# EAGLE design stm32f103_ethernet_shield (EAGLE 9.6.2)
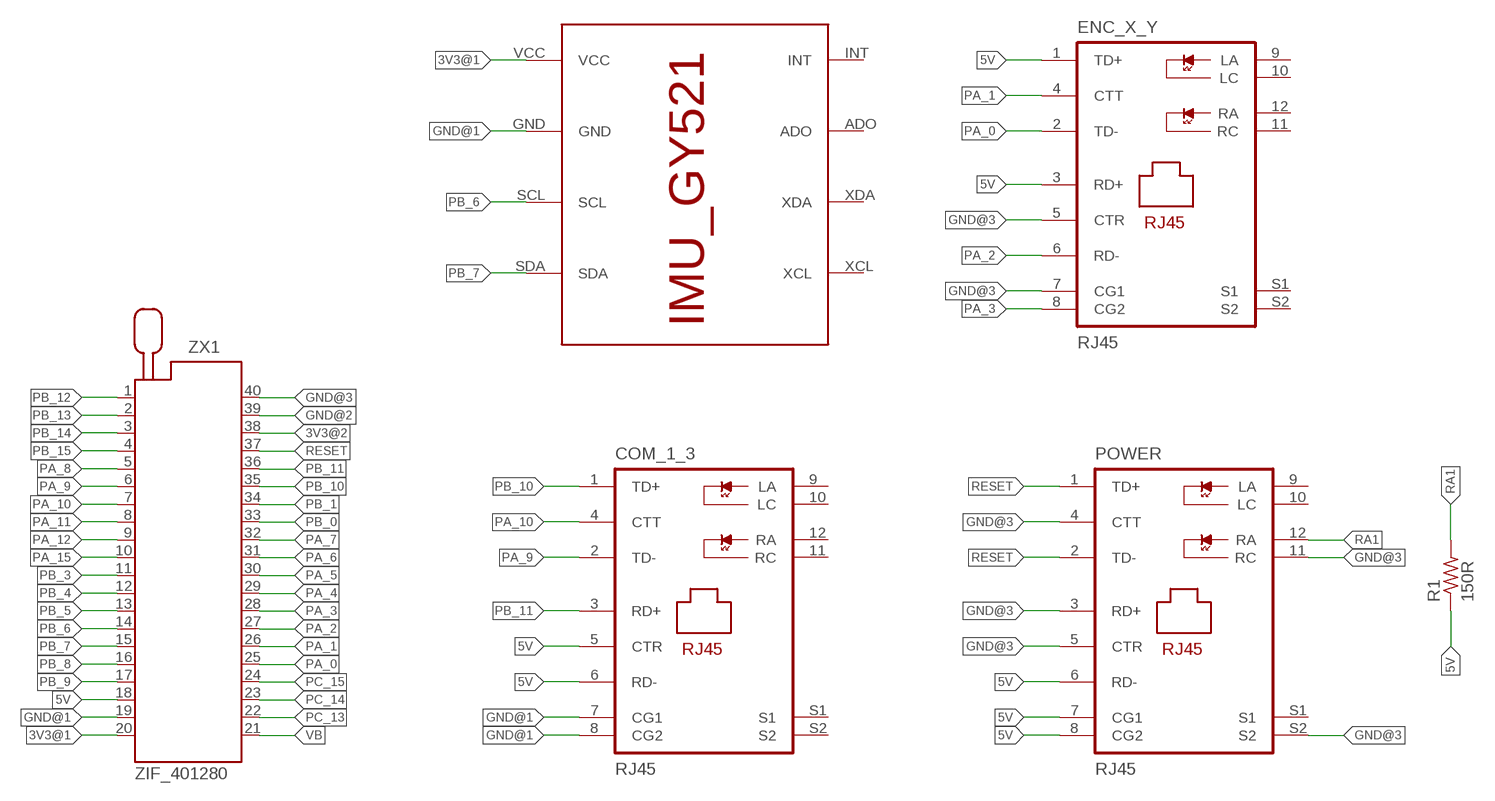
[diagram p0: schematic, sheet 1]

## Parts
COM_1_3  RJ45  RJ45_METAL_LEDS  [J0-A/B/F]
ENC_X_Y  RJ45  RJ45_METAL_LEDS  [J0-A/B/F]
MPU6050  IMU_ROBOCON_GY521  [IMU_GY521]
POWER  RJ45  RJ45_METAL_LEDS  [J0-A/B/F]
R1  150R  RES-7  [0204/7]
ZX1  ZIF_401280  [240-1280-00-0602J]

## Nets
3V3@1: MPU6050.VCC ZX1.20
3V3@2: ZX1.38
5V: COM_1_3.5(CTR) COM_1_3.6(RD-) ENC_X_Y.1(TD+) ENC_X_Y.3(RD+) POWER.6(RD-) POWER.7(CG1) POWER.8(CG2) R1.1 ZX1.18
GND@1: COM_1_3.7(CG1) COM_1_3.8(CG2) MPU6050.GND ZX1.19
GND@2: ZX1.39
GND@3: ENC_X_Y.5(CTR) ENC_X_Y.7(CG1) POWER.3(RD+) POWER.4(CTT) POWER.5(CTR) POWER.11(RC) POWER.S2 ZX1.40
PA_0: ENC_X_Y.2(TD-) ZX1.25
PA_1: ENC_X_Y.4(CTT) ZX1.26
PA_2: ENC_X_Y.6(RD-) ZX1.27
PA_3: ENC_X_Y.8(CG2) ZX1.28
PA_4: ZX1.29
PA_5: ZX1.30
PA_6: ZX1.31
PA_7: ZX1.32
PA_8: ZX1.5
PA_9: COM_1_3.2(TD-) ZX1.6
PA_10: COM_1_3.4(CTT) ZX1.7
PA_11: ZX1.8
PA_12: ZX1.9
PA_15: ZX1.10
PB_0: ZX1.33
PB_1: ZX1.34
PB_3: ZX1.11
PB_4: ZX1.12
PB_5: ZX1.13
PB_6: MPU6050.SCL ZX1.14
PB_7: MPU6050.SDA ZX1.15
PB_8: ZX1.16
PB_9: ZX1.17
PB_10: COM_1_3.1(TD+) ZX1.35
PB_11: COM_1_3.3(RD+) ZX1.36
PB_12: ZX1.1
PB_13: ZX1.2
PB_14: ZX1.3
PB_15: ZX1.4
PC_13: ZX1.22
PC_14: ZX1.23
PC_15: ZX1.24
RA1: POWER.12(RA) R1.2
RESET: POWER.1(TD+) POWER.2(TD-) ZX1.37
VB: ZX1.21
Unconnected: COM_1_3.9(LA) COM_1_3.10(LC) COM_1_3.11(RC) COM_1_3.12(RA) COM_1_3.S1 COM_1_3.S2 ENC_X_Y.9(LA) ENC_X_Y.10(LC) ENC_X_Y.11(RC) ENC_X_Y.12(RA) ENC_X_Y.S1 ENC_X_Y.S2 MPU6050.ADO MPU6050.INT MPU6050.XCL MPU6050.XDA POWER.9(LA) POWER.10(LC) POWER.S1

## Library data of the parts
COM_1_3 POWER = MIA_LIBRARY-2-2-2:RJ45_METAL_LEDS: RJ45 PulseJack w/LEDs
ENC_X_Y = MIA_LIBRARY-2-2-2:RJ45_METAL_LEDS: RJ45 PulseJack w/LEDs; SPICEPREFIX: X
MPU6050 = MIA_LIBRARY-2-2-2:IMU_ROBOCON_GY521
R1 = MIA_LIBRARY-2-2-2:RES-7
ZX1 = MIA_LIBRARY-2-2-2:ZIF_40: Zero Insertion Force Socked Source: http://www.3M.com/ehpd

## Board
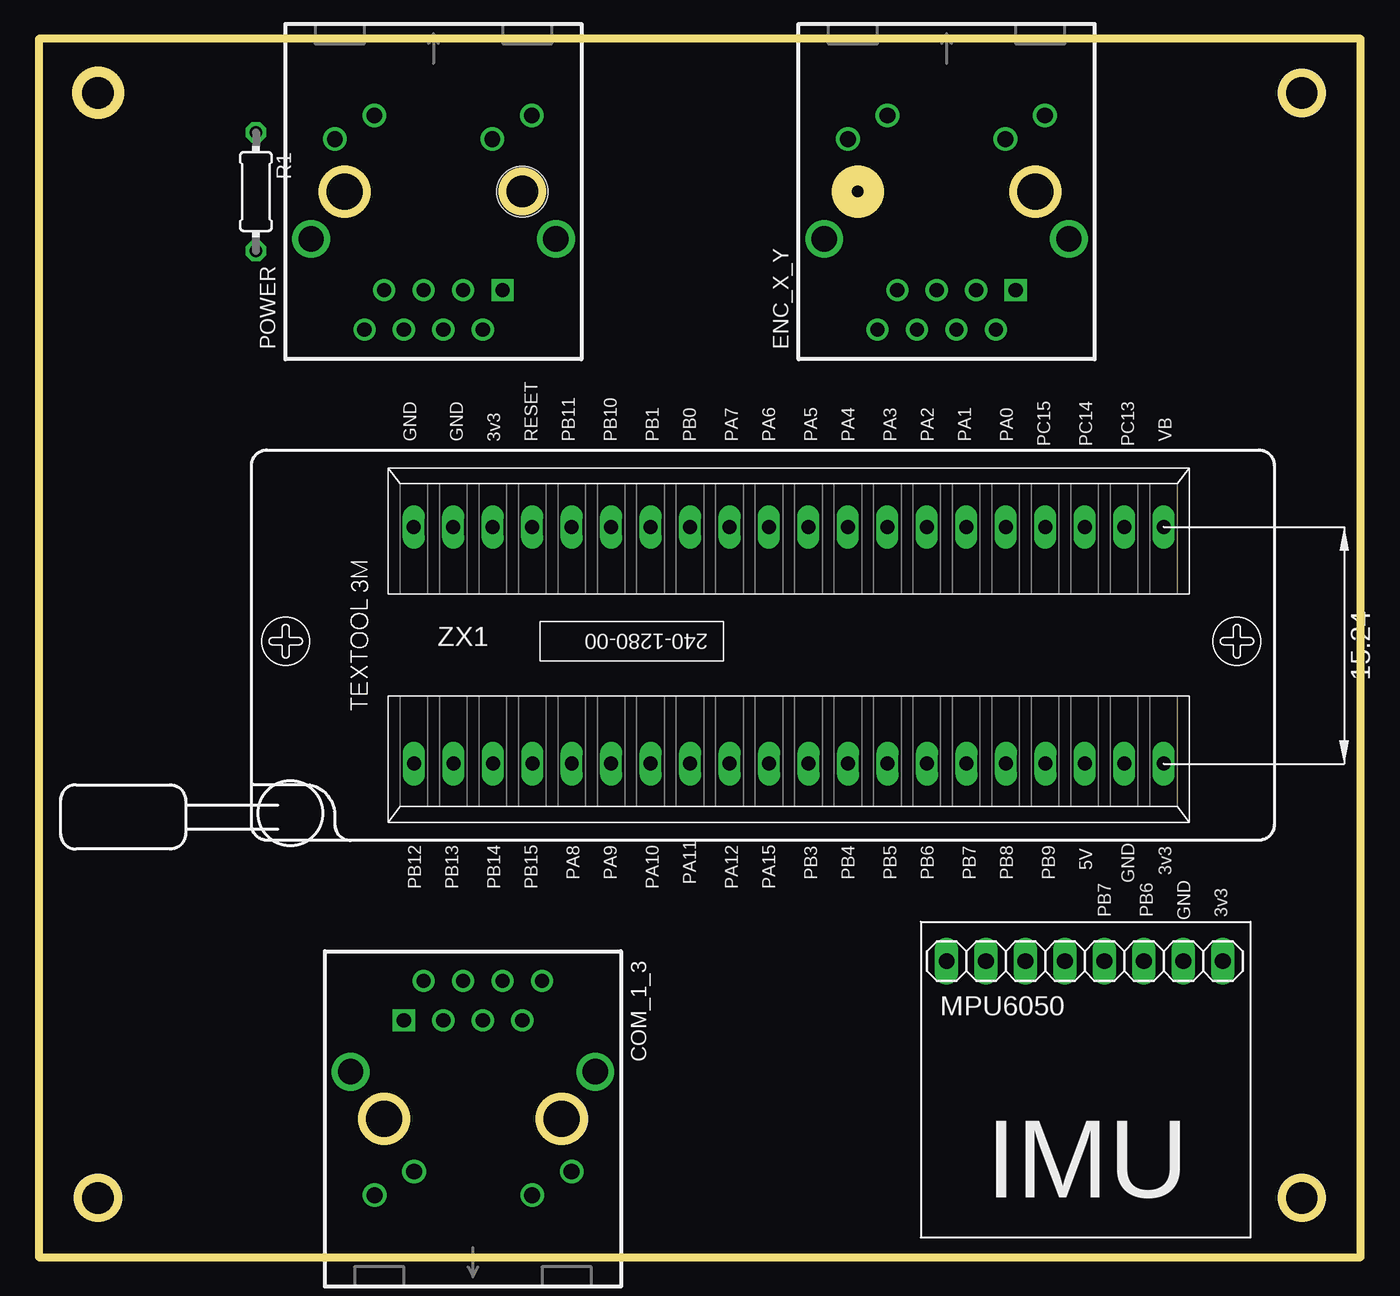
[diagram p1: board, top side]
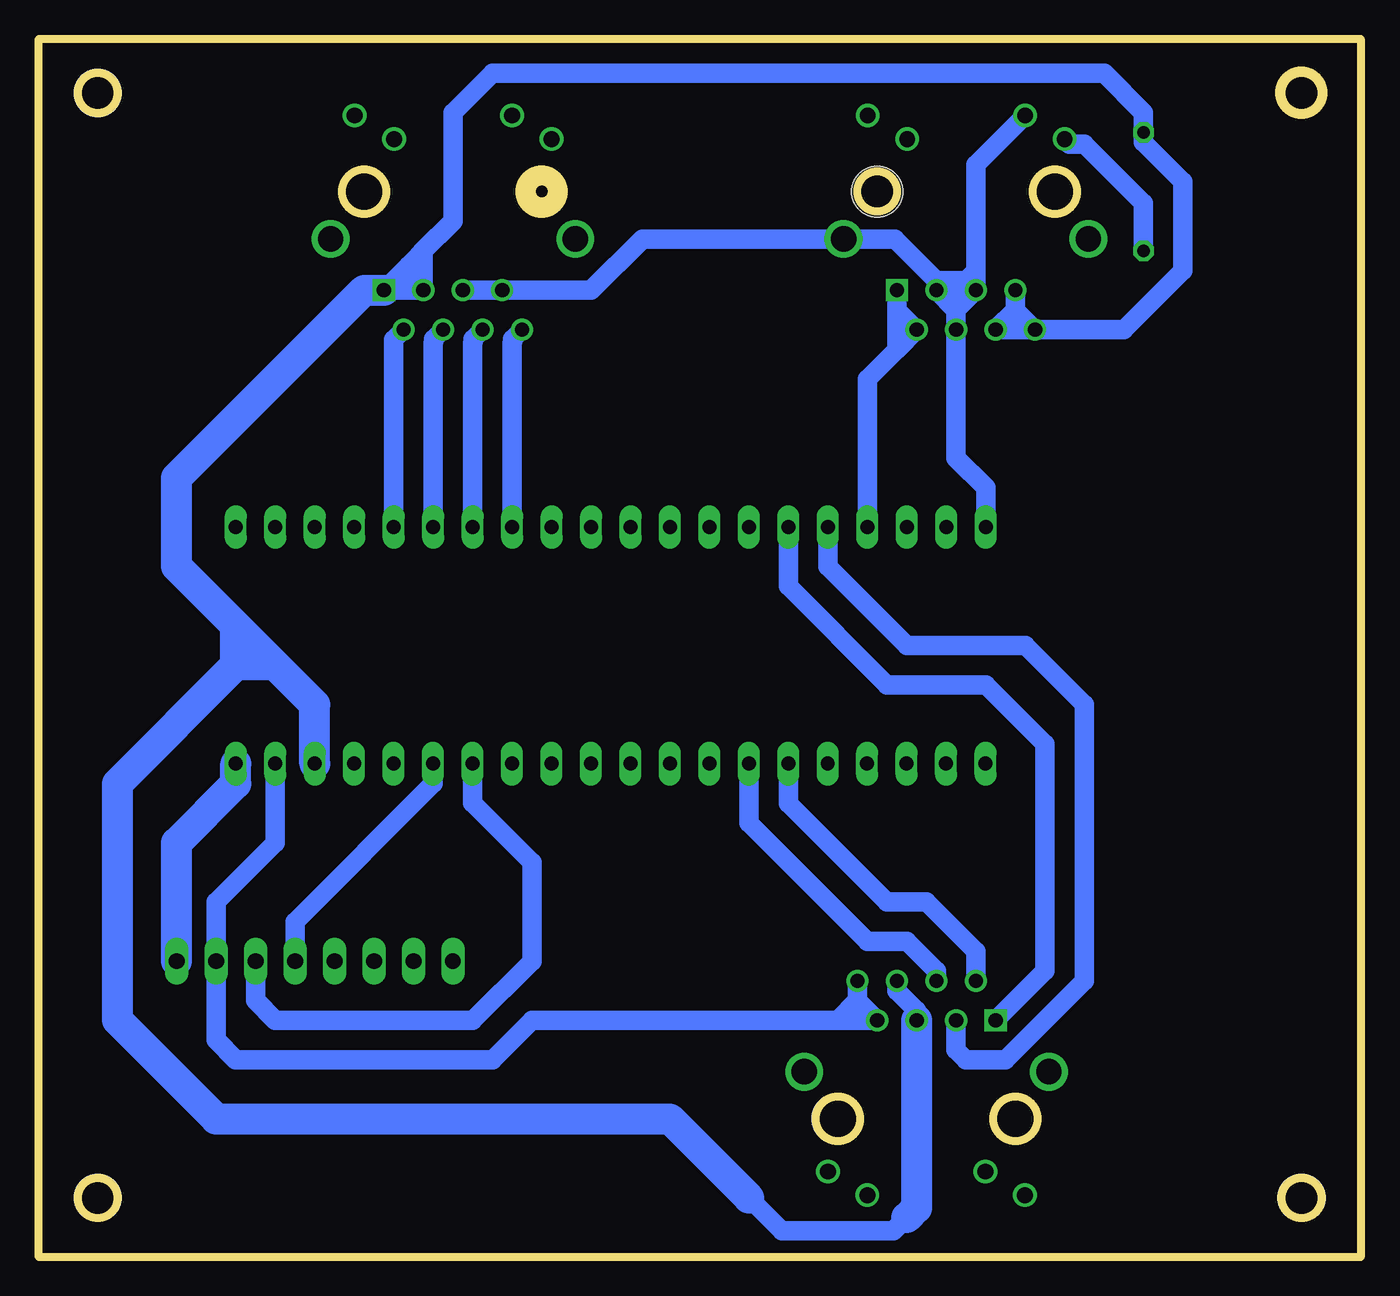
[diagram p2: board, bottom side, seen from below]

Size 85.07 x 78.41 mm. Coordinates in mm from the lower left corner, seen from the top.
Outline: 0,0 85.07,0 85.07,78.41 0,78.41 0,0
Outline: circle at 3.81,74.93 radius 1.27
Outline: circle at 81.28,74.93 radius 1.27
Outline: circle at 81.28,3.81 radius 1.27
Outline: circle at 3.81,3.81 radius 1.27
Outline: circle at 81.28,74.93 radius 1.27
Outline: circle at 81.28,3.81 radius 1.27
Outline: circle at 64.14,68.58 radius 1.42
Outline: circle at 52.7,68.58 radius 1.42
Outline: circle at 31.11,68.58 radius 1.27
Outline: circle at 19.68,68.58 radius 1.42
Outline: circle at 22.23,8.89 radius 1.42
Outline: circle at 33.66,8.89 radius 1.42
Outline: circle at 3.81,74.93 radius 1.42
Outline: circle at 52.7,68.58 radius 1.42
Outline: circle at 52.7,68.58 radius 1.42
Outline: circle at 52.7,68.58 radius 0.64
Outline: circle at 64.14,68.58 radius 1.42
Outline: circle at 52.7,68.58 radius 1.42
Outline: circle at 52.7,68.58 radius 0.9
Outline: circle at 52.7,68.58 radius 0.9
Copper layers (1*16): Top 0.035mm / dielectric 1.5mm / Bottom 0.035mm
Design rules "design_rules": minimum track width 0.8mm, minimum drill 1mm, track to track 0.6mm, track to pad 0.6mm, pad to pad 0.6mm, via to via 0.6mm, smd to smd 0.6mm, copper to edge 0.8mm, drill to drill 0.8mm, minimum pad ring 10mil, minimum via ring 8mil, stop-mask expansion 4mil, vias tented up to drill 0mil, thermal gap 10mil
Holes 3 mm at 3.81,74.93 3.81,3.81 81.28,3.81 81.28,74.93

### Footprints (pad centres in the part's own frame; a part is rotated, then mirrored left to right if it is on the bottom)
J0-A/B/F = drill 0.914 square: 1 4.445,-6.35 | drill 0.914: 2 3.175,-8.89; 3 1.905,-6.35; 4 0.635,-8.89; 5 -0.635,-6.35; 6 -1.905,-8.89; 7 -3.175,-6.35; 8 -4.445,-8.89 | drill 1.016: 9 6.325,4.902; 10 3.785,3.378; 11 -3.81,4.902; 12 -6.35,3.378 | drill 1.626: S1 -7.874,-3.048; S2 7.874,-3.048 | hole 3.251: -5.715,0; 5.715,0
IMU_GY521 = drill 1.016 long: ADO -6.35,0; GND 6.35,0; INT -8.89,0; SCL 3.81,0; SDA 1.27,0; VCC 8.89,0; XCL -3.81,0; XDA -1.27,0
0204/7 = drill 0.813 octagon: 1 -3.81,0; 2 3.81,0
240-1280-00-0602J = drill 0.9 long: 1 -24.12,-8.88; 2 -21.58,-8.88; 3 -19.04,-8.88; 4 -16.5,-8.88; 5 -13.96,-8.88; 6 -11.42,-8.88; 7 -8.88,-8.88; 8 -6.34,-8.88; 9 -3.8,-8.88; 10 -1.26,-8.88; 11 1.28,-8.88; 12 3.82,-8.88; 13 6.36,-8.88; 14 8.9,-8.88; 15 11.44,-8.88; 16 13.98,-8.88; 17 16.52,-8.88; 18 19.06,-8.88; 19 21.6,-8.88; 20 24.14,-8.88; 21 24.13,6.35; 22 21.59,6.35; 23 19.05,6.35; 24 16.51,6.35; 25 13.97,6.35; 26 11.43,6.35; 27 8.89,6.35; 28 6.35,6.35; 29 3.81,6.35; 30 1.27,6.35; 31 -1.27,6.35; 32 -3.81,6.35; 33 -6.35,6.35; 34 -8.89,6.35; 35 -11.43,6.35; 36 -13.97,6.35; 37 -16.51,6.35; 38 -19.05,6.35; 39 -21.59,6.35; 40 -24.13,6.35

### Placement (x,y rotation side)
COM_1_3  27.94,8.89 180 top
ENC_X_Y  58.42,68.58 0 top
MPU6050  67.31,19.05 0 top
POWER  25.4,68.58 0 top
R1  13.97,68.58 270 top
ZX1  48.26,40.64 0 top

### Tracks (layer width: path | path; a pad name or v marks a point on that pad's centre or on a via)
3V3@1
  Bottom 2: ZX1.20 72.39,30.48 76.2,26.67 MPU6050.VCC
5V
  Bottom 1.27: 60.96,62.23 ENC_X_Y.1 61.28,63.82 | 60.96,62.23 ENC_X_Y.3 60.33,64.14 | COM_1_3.6 29.84,17.14 28.57,15.88 COM_1_3.5 | 29.21,2.54 30.07,1.69 37.24,1.69 39.37,3.81 | POWER.8 15.24,59.69 11.43,63.5 11.43,69.22 13.97,71.75 R1.1 13.97,73.66 16.51,76.2 55.88,76.2 58.42,73.66 58.42,66.67 60.33,64.77 | 61.28,63.82 60.64,64.45 | 60.64,64.45 60.33,64.77 | 60.33,64.14 60.64,64.45 | 61.28,63.82 60.96,63.5 60.96,62.23 | 60.33,64.14 60.33,64.77 | POWER.8 POWER.6 22.23,60.96 | POWER.7 22.23,60.96 | POWER.8 22.23,60.96
  Bottom 2: 72.39,40.64 76.2,44.45 76.2,50.16 64.14,62.23 ENC_X_Y.1 | 72.39,40.64 71.12,39.37 | 71.12,39.37 69.85,38.1 | 69.85,38.1 67.31,35.56 ZX1.18 | COM_1_3.5 28.57,3.17 29.21,2.54 | 72.39,38.1 80.01,30.48 80.01,15.24 73.66,8.89 44.45,8.89 39.37,3.81 | 71.12,39.37 72.39,38.1 | 69.85,38.1 72.39,38.1 | 72.39,38.1 72.39,40.64
GND@1
  Bottom 1.27: ZX1.19 69.86,26.66 73.66,22.86 MPU6050.GND 73.66,13.97 72.39,12.7 55.88,12.7 53.34,15.24 34.29,15.24 33.66,15.24 | COM_1_3.8 32.38,16.51 | 32.38,16.51 COM_1_3.7 33.66,15.24 | 32.38,16.51 33.66,15.24
GND@3
  Bottom 1.27: ENC_X_Y.5 ENC_X_Y.7 49.53,62.23 46.23,65.53 34.92,65.53 POWER.S2 | POWER.3 POWER.5 | POWER.11 24.77,70.31 24.77,63.5 | 24.77,63.5 POWER.5 | 24.77,63.5 25.41,62.86 27.3,62.86 | POWER.3 26.04,60.96 | 26.04,60.96 POWER.4 26.04,51.44 24.13,49.53 ZX1.40 | 26.04,60.96 POWER.5 | POWER.S2 33.29,65.55 33.26,65.55 POWER.S2 | POWER.3 27.3,62.86 | 27.3,62.86 29.96,65.52 32.38,65.52 32.4,65.53 POWER.S2
PA_0
  Bottom 1.27: ENC_X_Y.2 62.23,59.05 ZX1.25
PA_1
  Bottom 1.27: ENC_X_Y.4 59.65,59.1 59.65,58.88 59.69,58.84 ZX1.26
PA_2
  Bottom 1.27: ENC_X_Y.6 57.11,59.1 57.11,58.88 57.15,58.84 ZX1.27
PA_3
  Bottom 1.27: ENC_X_Y.8 54.57,59.1 54.57,58.88 54.61,58.84 ZX1.28
PA_9
  Bottom 1.27: COM_1_3.2 24.77,19.68 27.94,22.86 30.48,22.86 36.83,29.21 ZX1.6
PA_10
  Bottom 1.27: ZX1.7 39.38,27.95 31.75,20.32 29.21,20.32 27.3,18.41 COM_1_3.4
PB_6
  Bottom 1.27: MPU6050.SCL 71.12,16.51 69.85,15.24 57.15,15.24 53.34,19.05 53.34,25.4 57.16,29.22 ZX1.14
PB_7
  Bottom 1.27: ZX1.15 59.69,30.48 68.58,21.59 MPU6050.SDA
PB_10
  Bottom 1.27: ZX1.35 36.83,43.18 30.48,36.83 24.13,36.83 20.32,33.02 20.32,18.41 COM_1_3.1
PB_11
  Bottom 1.27: COM_1_3.3 26.04,13.34 25.4,12.7 22.86,12.7 17.78,17.78 17.78,35.56 21.59,39.37 29.21,39.37 34.29,44.45 ZX1.36
RA1
  Bottom 1.27: POWER.12 18.73,71.64 17.78,71.64 13.97,67.83 R1.2
RESET
  Bottom 1.27: POWER.1 29.84,60.96 | 29.84,60.96 POWER.2 29.84,58.42 | ZX1.37 31.75,56.52 29.84,58.42 | 29.84,60.96 29.84,58.42

### Text on the board
tPlace: GND | GND | 3v3 | RESET | PB11 | PB10 | PB1 | PB0 | PA7 | PA6 | PA5 | PA4 | PA3 | PA2 | PA1 | PA0 | PC15 | PC14 | PC13 | VB | 5V | 3v3 | PB12 | PB13 | PB14 | PB15 | PA8 | PA9 | PA10 | PA11 | PA12 | PA15 | PB3 | PB4 | PB5 | PB6 | PB7 | PB8 | PB9 | GND | PB7 | PB6 | GND | 3v3